# Altium schematic sheet PowerSupply.SchDoc
size A3; SheetNumber: 3; SheetTotal: 3; SPICEModelCacheXXZZNZKW: <root> / <DocumentId>XXZZNZKW</DocumentId> / <CacheFrame Number="0"> / <Model Name="cap" Kind="MDL"> / <Text>*Default semiconductor capacitor / .MODEL CAP C()</Text> / </Model> / </CacheFrame> / </root>
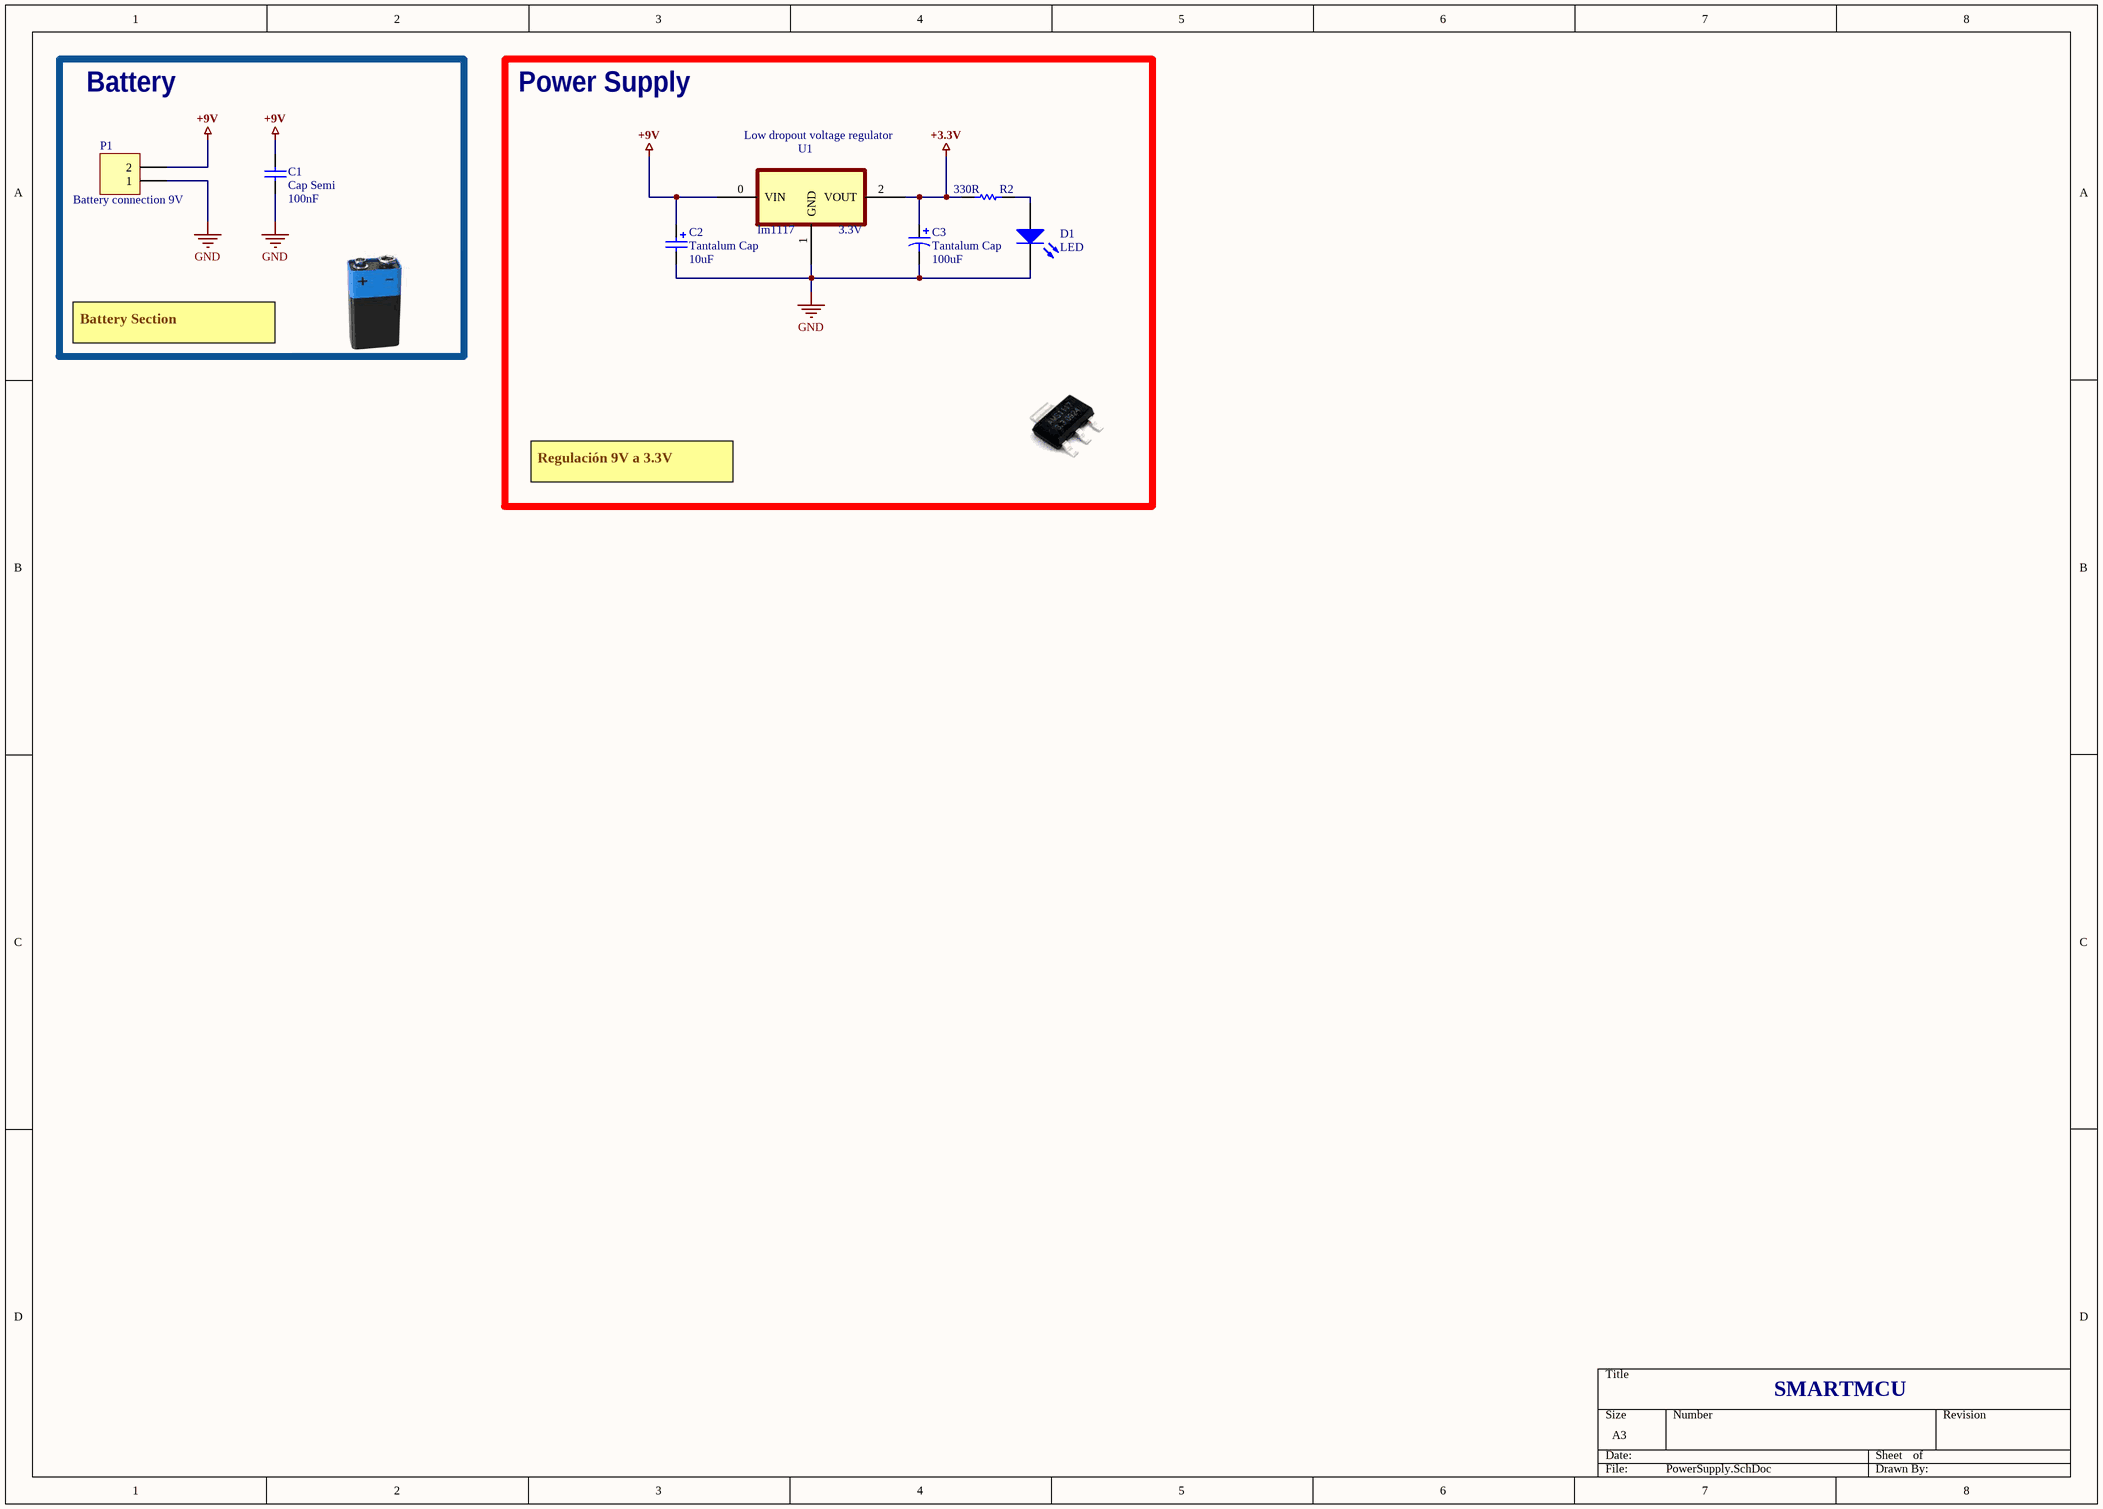
[diagram p0: PowerSupply.SchDoc]

## Parts
C1  Cap Semi  value 100nF  [C1206]
C2  Tantalum Cap  value 10uF  [C1206]
C3  Tantalum Cap  value 100uF  [C1206]
D1  LED  [MY_LED_0805]
P1  Battery connection 9V  [HDR1X2H]
R2  330R  [MY_0805]
U1  Low dropout voltage regulator  output voltage: 3.3V  [4-Pin SOT]

## Blocks framed on the sheet
Battery: C1 P1
Power Supply: C2 C3 D1 R2 U1

## Nets
+3.3V: C3.2 R2.1 U1.2(VOUT)
+9V: C1.2 C2.2 P1.2 U1.0(VIN)
GND: C1.1 C2.1 C3.1 D1.K P1.1 U1.1(GND)
NetD1_A: D1.A R2.2

## Notes on the sheet
- Battery Section
- Regulación 9V a 3.3V
- SMARTMCU

## Library data of the parts
C1 = Cap Semi: Capacitor (Semiconductor SIM Model)  100nF; Published: 8-Jun-2000; LatestRevisionDate: 29-May-2009; LatestRevisionNote: IPC-7351 Footprint Added.; PackageReference: C1206; Publisher: Altium Limited; PackageDescription: Chip Capacitor
C2 C3 = Cap Pol1: Polarized Capacitor (Radial); Published: 8-Jun-2000; LatestRevisionDate: 17-Jul-2002; LatestRevisionNote: Re-released for DXP Platform.; PackageReference: RB7.6-15; Publisher: Altium Limited; PackageDescription: Polarized Capacitor (Radial); 2 Leads
D1 = LED: Typical INFRARED GaAs LED; ASiD Part Number: LED-AS
P1 = Header 2H: Header, 2-Pin, Right Angle; LatestRevisionDate: 17-Jul-2002; LatestRevisionNote: Re-released for DXP Platform.; Publisher: Altium Limited
R2 = Res: Standard resistor; ASiD Part Number: Res-AS; Value: 330R
U1 = lm1117: The LM1117 is a low dropout voltage regulator with a / dropout of 1.2 V at 800 mA of load current. / The LM1117 is available in an adjustable version, / which can set the output voltage from 1.25 V to 13.8 V / with only two external resistors. In addition, the device / is available in five fixed voltages, 1.8 V, 2.5 V, 3.3 V, / and 5 V.; ComponentLink1Description: Datasheet; ComponentLink1URL: https://www.bing.com/ck/a?!&&p=a5a244ffbc41c431JmltdHM9MTY5MTc5ODQwMCZpZ3VpZD0zMWY2OWVhOS1hOGQ2LTYwMDQtMGU2MC04Y2M4YTk3ZTYxNDYmaW5zaWQ9NTE5NA&ptn=3&hsh=3&fclid=31f69ea9-a8d6-6004-0e60-8cc8a97e6146&psq=lm1117+pdf&u=a1aHR0cHM6Ly93d3cudGkuY29tL2xpdC9kcy9zeW1saW5rL2xtMTExNy5wZGY&ntb=1; Modelo: lm1117